# Altium schematic sheet ZOWI_Main_Board_Booster.SchDoc: Booster
size A4; Date: 20140218; Author: Raúl de Pablos; CompanyName: bq - Mundo Reader; Organization: bq - Mundo Reader; DocumentNumber: 5; Revision: 1.0; SheetNumber: 5; SheetTotal: 9; ProjectName: ZOWI_Main_Board
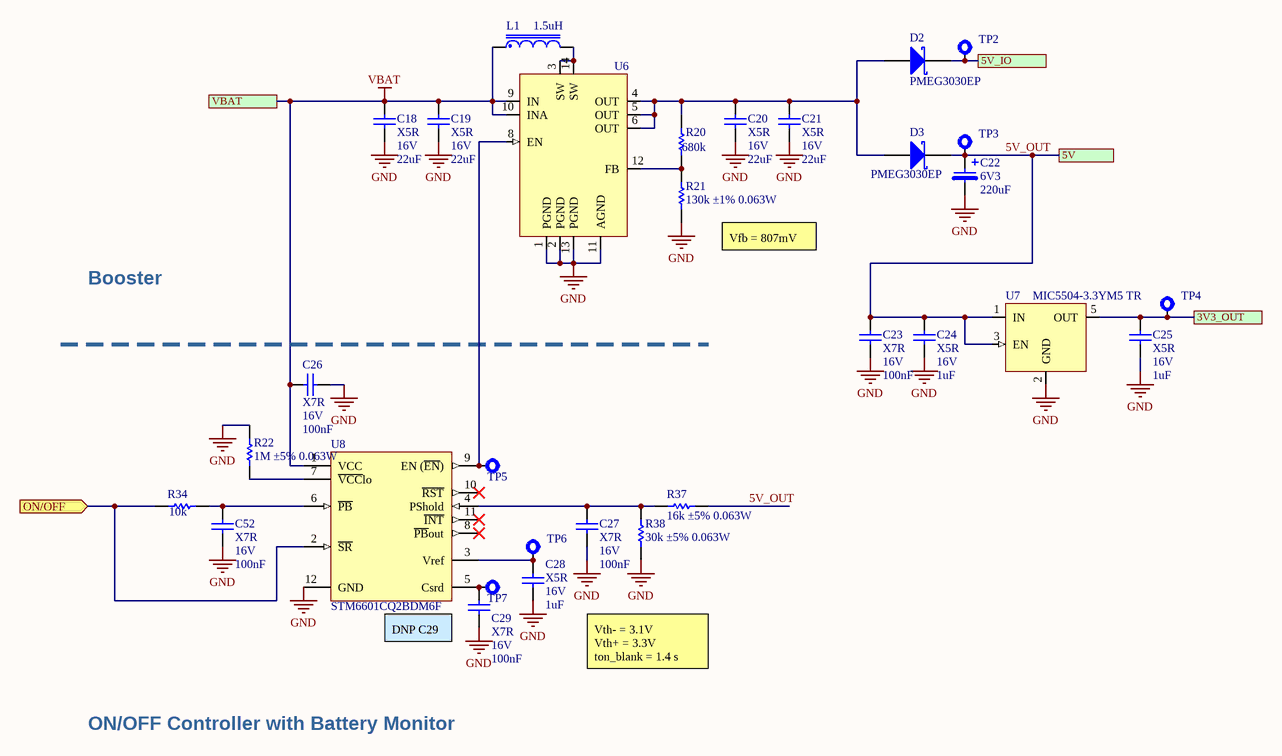
[diagram p0: ZOWI_Main_Board_Booster.SchDoc]

## Parts
C18  Dielectric: X5R  Voltage: 16V  Capacitance: 22uF  [C0805]  (hidden comment: Capacitor)
C19  Dielectric: X5R  Voltage: 16V  Capacitance: 22uF  [C0805]  (hidden comment: Capacitor)
C20  Dielectric: X5R  Voltage: 16V  Capacitance: 22uF  [C0805]  (hidden comment: Capacitor)
C21  Dielectric: X5R  Voltage: 16V  Capacitance: 22uF  [C0805]  (hidden comment: Capacitor)
C22  Voltage: 6V3  Capacitance: 220uF  [CASE_D]  (hidden comment: Electrolytic)
C23  Dielectric: X7R  Voltage: 16V  Capacitance: 100nF  [C0402]  (hidden comment: Capacitor)
C24  Dielectric: X5R  Voltage: 16V  Capacitance: 1uF  [C0603]  (hidden comment: Capacitor)
C25  Dielectric: X5R  Voltage: 16V  Capacitance: 1uF  [C0603]  (hidden comment: Capacitor)
C26  Dielectric: X7R  Voltage: 16V  Capacitance: 100nF  [C0402]  (hidden comment: Capacitor)
C27  Dielectric: X7R  Voltage: 16V  Capacitance: 100nF  [C0402]  (hidden comment: Capacitor)
C28  Dielectric: X5R  Voltage: 16V  Capacitance: 1uF  [C0603]  (hidden comment: Capacitor)
C29  Dielectric: X7R  Voltage: 16V  Capacitance: 100nF  [C0402]  (hidden comment: Capacitor)  (no BOM)
C52  Dielectric: X7R  Voltage: 16V  Capacitance: 100nF  [C0402]  (hidden comment: Capacitor)
D2  PMEG3030EP  [SOD128]
D3  PMEG3030EP  [SOD128]
L1  L: 1.5uH  [SRN5040]  (hidden comment: SRN5040-1R5Y)
R20  Resistance: 680k  [R0402]  (hidden comment: Resistor)
R21  value 130k ±1% 0.063W  [R0402]  (hidden comment: Resistor)
R22  value 1M ±5% 0.063W  [R0402]  (hidden comment: Resistor)
R34  Resistance: 10k  [R0402]  (hidden comment: Resistor)
R37  value 16k ±5% 0.063W  [R0402]  (hidden comment: Resistor)
R38  value 30k ±5% 0.063W  [R0402]  (hidden comment: Resistor)
TP2  Testpoint  [TP_SMD_1mm]  (value not drawn)  (no BOM)
TP3  Testpoint  [TP_SMD_1mm]  (value not drawn)  (no BOM)
TP4  Testpoint  [TP_SMD_1mm]  (value not drawn)  (no BOM)
TP5  Testpoint  [TP_SMD_1mm]  (value not drawn)  (no BOM)
TP6  Testpoint  [TP_SMD_1mm]  (value not drawn)  (no BOM)
TP7  Testpoint  [TP_SMD_1mm]  (value not drawn)  (no BOM)
U6  MP3421GG-Z  [QFN14_2X2]  (value not drawn)
U7  MIC5504-3.3YM5 TR  [SOT23-5]
U8  Part Number: STM6601CQ2BDM6F  [TDFN12]  (hidden comment: STM6601)

## Ports
3V3_OUT, 5V, 5V_IO, ON/OFF (in), VBAT

## Nets
GND: C18.1 C19.1 C20.1 C21.1 C22.2 C23.1 C24.1 C25.1 C26.2 C27.1 C28.1 C29.1 C52.1 R21.1 R22.1 R38.1 U6.1(PGND) U6.2(PGND) U6.11(AGND) U6.13(PGND) U7.2(GND) U8.12(GND)
VBAT: C18.2 C19.2 C26.1 L1.1 U6.9(IN) U6.10(INA) U8.1(VCC) ; port VBAT
3V3_OUT: C25.2 TP4.1 U7.5(OUT) ; port 3V3_OUT
5V_IO: D2.k(K) TP2.1 ; port 5V_IO
5V_OUT: C22.1 C23.2 C24.2 D3.k(K) R37.2 TP3.1 U7.1(IN) U7.3(EN) ; port 5V
ON/OFF: R34.2 U8.2(~{SR}) ; port ON/OFF
NetC20_2: C20.2 C21.2 D2.A D3.A R20.2 U6.4(OUT) U6.5(OUT) U6.6(OUT)
NetC27_2: C27.2 R37.1 R38.2 U8.4(PShold)
NetC28_2: C28.2 TP6.1 U8.3(Vref)
NetC29_2: C29.2 TP7.1 U8.5(Csrd)
NetC52_2: C52.2 R34.1 U8.6(~{PB})
NetL1_2: L1.2 U6.3(SW) U6.14(SW)
NetR20_1: R20.1 R21.2 U6.12(FB)
NetR22_2: R22.2 U8.7(~{VCC}lo)
NetTP5_1: TP5.1 U6.8(EN) U8.9(EN_(~{EN}))

Not connected (* = marked no-connect by the designer): U8 8(~{PB}out)* 10(~{RST})* 11(~{INT})*

## Notes on the sheet
- Booster
- (near R21) Vfb = 807mV
- DNP C29
- Vth- = 3.1V
  Vth+ = 3.3V
  ton_blank = 1.4 s
- ON/OFF Controller with Battery Monitor
- Title
- Project
- Size:
- Author
- A4
- Number:
- Revision:
- Mundo Reader, S.L. All rights reserved. No part of these pages, either text or image may be used for any purpose other than personal use. Therefore, reproduction, modification, storage in a retrieval system or retransmission, in any form or by any means, electronic, mechanical or otherwise, for reasons other than personal use, is strictly prohibited without prior written permission.
- Date:
- Time:
- Sheet
- of

## Library data of the parts
C18-C21 = C0805_22uF_16V_±10%: Capacitor SMD; Part Number: C0805_22uF_16V_±20%; Manufacturer: Murata; Value: 22uF ±20% 16V; Tolerance: ±20%; OrderingCode: GRM219R61C226ME15K; Temp_ Max: 85; Temp_ Min: -55
C22 = Cap_Al_220uF_6V3: Capacitor, Electrolytic, SMD; Manufacturer: Panasonic; Value: 220uF 6V3; OrderingCode: EEE-0JA221WP; Temp_ Max: 85; Temp_ Min: -40; Part Number: Cap_Al_220uF_6V3
C23 C26 C27 C29 C52 = C0402_100nF_16V_±10%: Capacitor SMD; Manufacturer: Kemet; Value: 100nF ±10% 16V; Tolerance: ±10%; OrderingCode: C0402C104K4RAC; Temp_ Max: 125; Temp_ Min: -55; Part Number: C0402_100nF_16V_±10%
C24 C25 C28 = C0603_1uF_16V_±10%: Capacitor SMD; Manufacturer: Kemet; Value: 1uF ±10% 16V; Tolerance: ±10%; OrderingCode: C0603C105K4PAC; Temp_ Max: 125; Temp_ Min: -55; Part Number: C0603_1uF_16V_±10%
D2 D3 = PMEG3030EP: Schottky Diode; Manufacturer: NXP; Ifor: 3A; Vrrm: 30V; Ifsm: 50A; Vf: 0,36V; Temp_ Max: 150; Temp_ Min: -55; Value: 3A 30V; Part Number: PMEG3030EP; OrderingCode: PMEG3030EP
L1 = 1.5uH_3,5A: Inductor, Power, SMD; Manufacturer: Bourns; Rdc: 0,018; Current: 3,5A; Current Sat#: 6A; Temp_ Max: 125; Temp_ Min: -40; Value: 1.5uH 3,5A; Part Number: 1.5uH_3,5A; OrderingCode: SRN5040-1R5Y
R20 = R0402_680k_0.063W_±1%: Resistor, SMD; Manufacturer: Vishay; Tolerance: ±1%; OrderingCode: CRCW0402680KFK; Power: 0.063W; Value: 680k ±1% 0.063W; Temp_ Max: 155; Temp_ Min: -55; PackageDescription: SMD; Part Number: R0402_680k_0.063W_±1%
R21 = R0402_130k_0.063W_±1%: Resistor, SMD; Manufacturer: Vishay; Tolerance: ±1%; OrderingCode: CRCW0402130KFK; Power: 0.063W; Resistance: 130k; Temp_ Max: 155; Temp_ Min: -55; PackageDescription: SMD; Part Number: R0402_130k_0.063W_±1%
R22 = R0402_1M_0.063W_±5%: Resistor, SMD; Manufacturer: Vishay; Tolerance: ±5%; OrderingCode: CRCW04021M00JNED; Power: 0.063W; Resistance: 1M; Temp_ Max: 155; Temp_ Min: -55; PackageDescription: SMD; Part Number: R0402_1M_0.063W_±5%
R34 = R0402_10k_0.063W_±5%: Resistor, SMD; Manufacturer: Vishay; Tolerance: ±5%; OrderingCode: CRCW040210K0JN; Power: 0.063W; Value: 10k ±5% 0.063W; Temp_ Max: 155; Temp_ Min: -55; PackageDescription: SMD; Part Number: R0402_10k_0.063W_±5%
R37 = R0402_16k_0.063W_±5%: Resistor, SMD; Manufacturer: Vishay; Tolerance: ±5%; OrderingCode: CRCW040216K0JN; Power: 0.063W; Resistance: 16k; Temp_ Max: 155; Temp_ Min: -55; PackageDescription: SMD; Part Number: R0402_16k_0.063W_±5%
R38 = R0402_30k_0.063W_±5%: Resistor, SMD; Manufacturer: Vishay; Tolerance: ±5%; OrderingCode: CRCW040230K0JN; Power: 0.063W; Resistance: 30k; Temp_ Max: 155; Temp_ Min: -55; PackageDescription: SMD; Part Number: R0402_30k_0.063W_±5%
TP2-TP7 = TP_SMD_1mm: Manufacturer: Oxley; OrderingCode: SMOX/060/B1; SAP: 303552; Part Number: TP_SMD_1mm
U6 = MP3421: Synchronous Boost Regulator with Bi-Directional Load Disconnect; Manufacturer: MPS; Voltage IN: 1,9÷5.5 VDC; Voltage OUT: 2,5÷5.5 VDC; Current OUT: 2.1A; Temp_ Max: 125; Temp_ Min: -40; Part Number: MP3421; OrderingCode: MP3421GG-Z
U7 = MIC5504-3.3: LDO 300mA; Manufacturer: Micrel; Voltage IN: 2,5÷5,5 VDC; Voltage OUT: 3.3VDC; Temp_ Max: 125; Temp_ Min: -40; Part Number: MIC5504-3.3; Current OUT: 300 mA; OrderingCode: MIC5504-3.3YM5 TR
U8 = STM6601CQ2BDM6F: Smart push-button on/off controller; Manufacturer: ST Microelectronics; Temp_ Max: 85; Temp_ Min: -40; OrderingCode: STM6601CQ2BDM6F